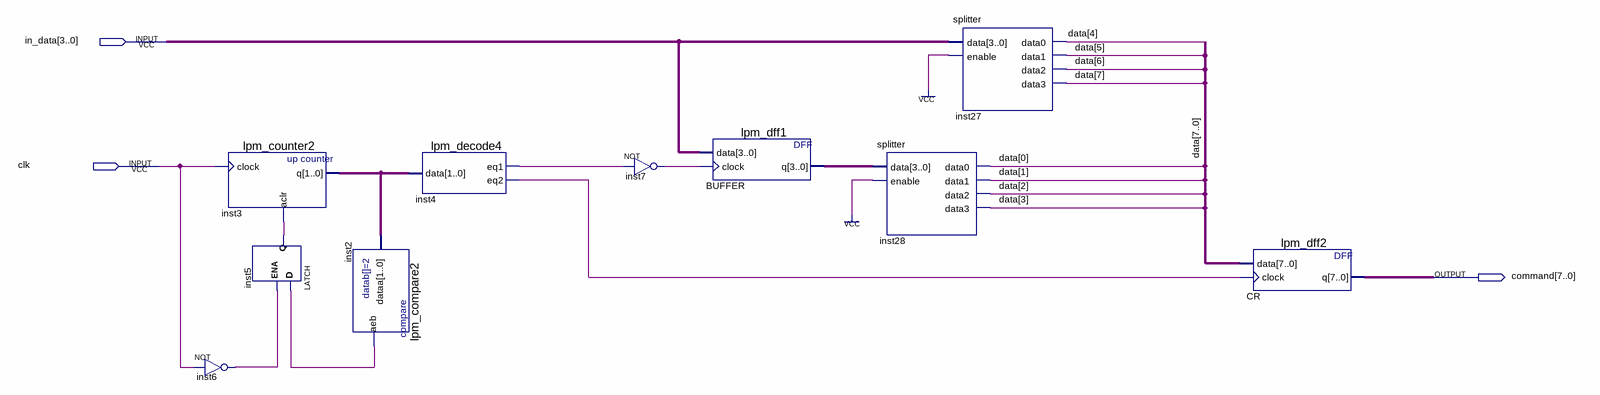
[diagram p0: schematic sheet]
// Quartus schematic ad_reg.bdf as structural Verilog: 10 symbols, 3 pins
module ad_reg (
  input  [3:0] in_data,
  input  clk,
  output [7:0] command
);

  wire inst2_aeb, inst4_eq1, inst4_eq2, inst5_q, inst6_out, inst7_out;
  wire [1:0] inst3_q;
  wire [3:0] BUFFER_q;
  wire [7:0] data;

  lpm_counter2 inst3 (.clock(clk), .aclr(inst5_q), .q(inst3_q));
  not inst6 (inst6_out, clk);
  LATCH inst5 (.D(inst2_aeb), .ENA(inst6_out), .Q(inst5_q));
  lpm_compare2 inst2 (.dataa(inst3_q), .aeb(inst2_aeb));
  lpm_decode4 inst4 (.data(inst3_q), .eq1(inst4_eq1), .eq2(inst4_eq2));
  not inst7 (inst7_out, inst4_eq1);
  lpm_dff1 BUFFER (.data(in_data), .clock(inst7_out), .q(BUFFER_q));
  splitter inst28 (.data(BUFFER_q), .enable(1'b1), .data0(data[0]), .data1(data[1]), .data2(data[2]), .data3(data[3]));
  splitter inst27 (.data(in_data), .enable(1'b1), .data0(data[4]), .data1(data[5]), .data2(data[6]), .data3(data[7]));
  lpm_dff2 CR (.data(data), .clock(inst4_eq2), .q(command));
endmodule
